# EAGLE design Pluvion 2 - Rev C (EAGLE 7.6.0)

## Sheet 1 of 3
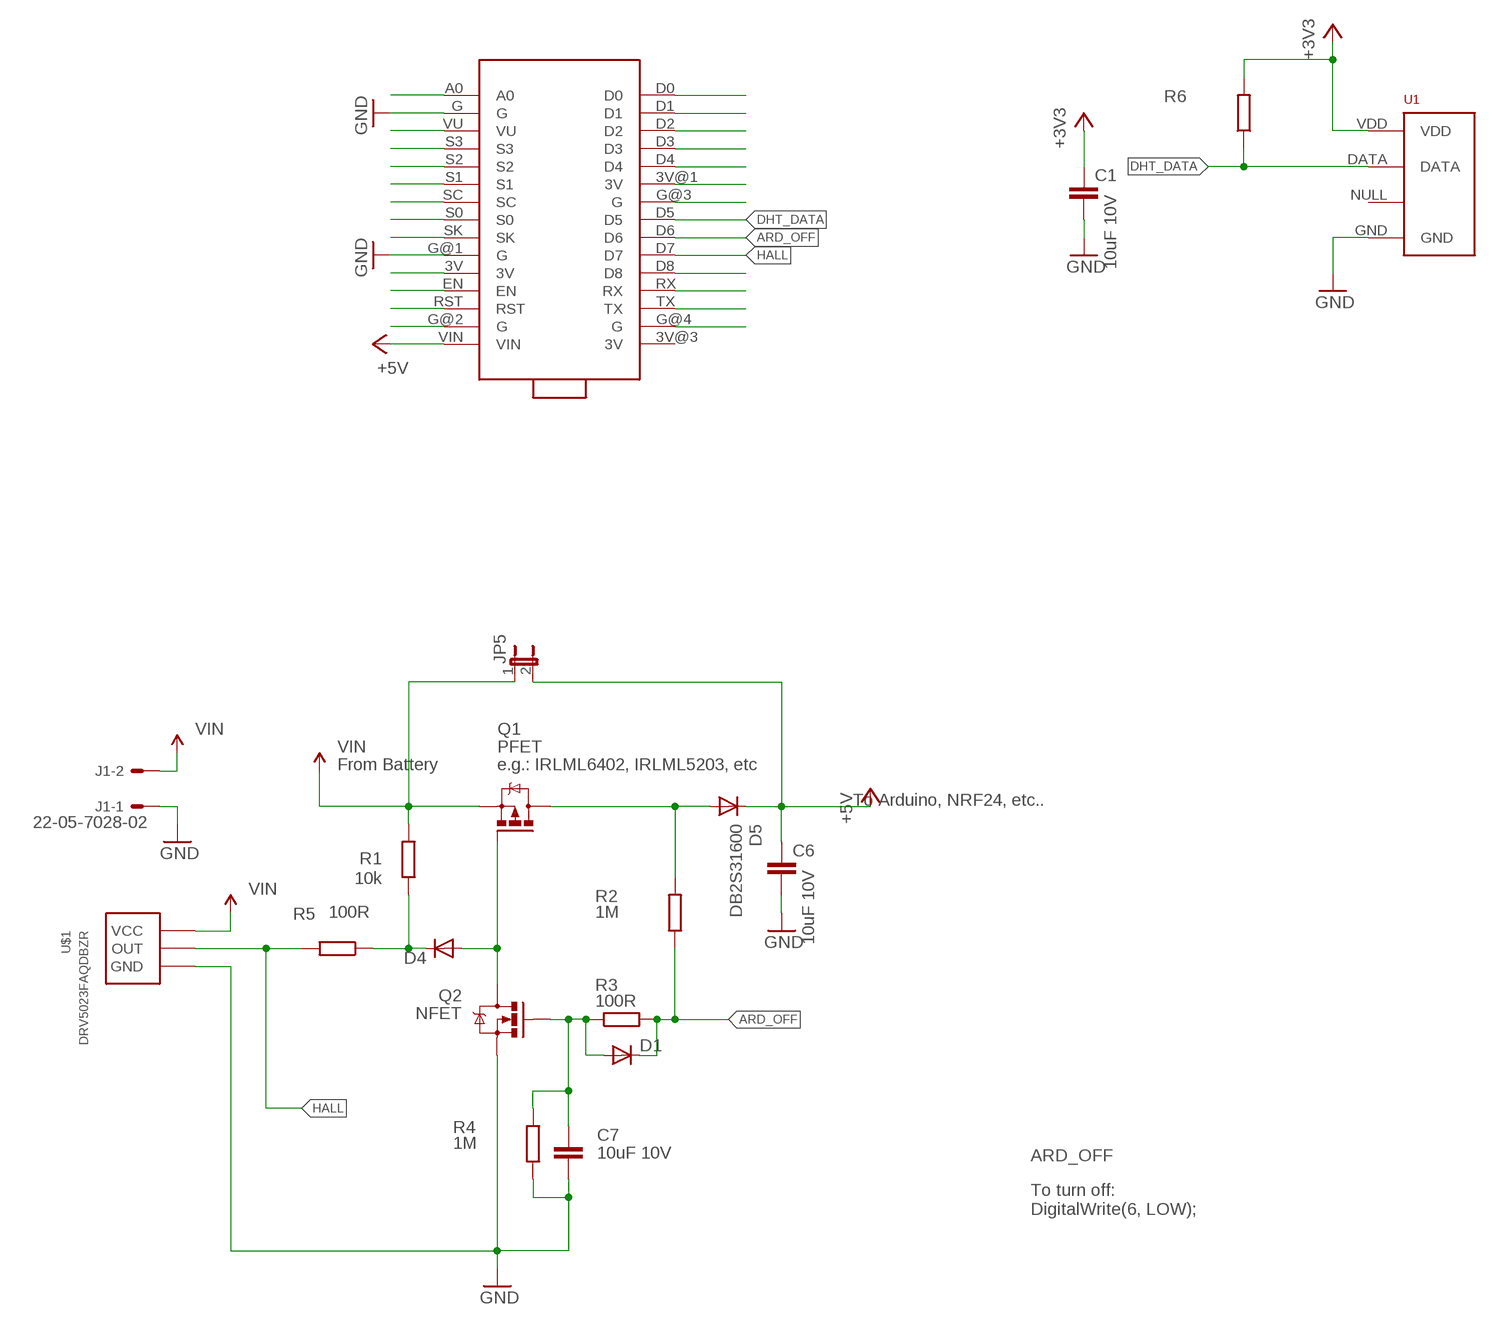
[diagram p0: schematic, sheet 1]

### Parts
C1  10uF 10V  C-EUC0805  [C0805]
C6  10uF 10V  C-EUC0805  [C0805]
C7  10uF 10V  C-EUC0805  [C0805]
D1  DIODESOD  [SOD-323]
D4  DIODESOD  [SOD-323]
D5  DB2S31600  DIODESMA  [SMA-DIODE]
J1  22-05-7028-02  [7395-02]
JP5  JUMPER-2PTH  [1X02]
Q1  PFET  IRLML5203  [MICRO3]
Q2  NFET  MOSFET-NCHANNELBSS123LT1G  [SOT23]
R1  10k  R-EU_R0805  [R0805]
R2  1M  R-EU_R0805  [R0805]
R3  100R  R-EU_R0805  [R0805]
R4  1M  R-EU_R0805  [R0805]
R5  100R  R-EU_R0805  [R0805]
R6  R-EU_R0805  [R0805]
U1  RHT03_DHT-22_AM2302RA  [RHT03_DHT-22/RA]
U$1  DRV5023FAQDBZR  [SOT23]
U$2  NODE-LOLIN-ESP8266  [NODE-LOLIN-ESP8266]

### Nets
+3V3: C1.1 R6.2 U1.VDD U$2.3V@1(3V)
+5V: C6.1 D5.C JP5.2 U$2.VIN
ARD_OFF: D1.1(C) R2.1 R3.2 U$2.D6
BUTTONS: D4.2(A) Q1.1(G) Q2.3(D)
DHT_DATA: R6.1 U1.DATA U$2.D5
GND: C1.2 C6.2 C7.2 J1.1 Q2.2(S) R4.1 U1.GND U$1.3(GND) U$2.G U$2.G@1(G)
HALL: R5.2 U$1.2(OUT) U$2.D7
N$1: D5.A Q1.3(D) R2.2
N$2: C7.1 D1.2(A) Q2.1(G) R3.1 R4.2
N$3: U$2.D0
N$4: U$2.D1
N$5: U$2.D2
N$6: U$2.D3
N$7: U$2.D4
N$8: D4.1(C) R1.1 R5.1
N$11: U$2.D8
N$12: U$2.G@3(G)
N$13: U$2.G@4(G)
N$15: U$2.RX
N$16: U$2.TX
N$17: U$2.3V
N$19: U$2.A0
N$21: U$2.VU
N$22: U$2.S3
N$23: U$2.S2
N$24: U$2.S1
N$25: U$2.SC
N$26: U$2.S0
N$27: U$2.SK
N$30: U$2.EN
N$31: U$2.RST
N$32: U$2.G@2(G)
VIN: J1.2 JP5.1 Q1.2(S) R1.2 U$1.1(VCC)
Unconnected: U1.NULL U$2.3V@3(3V)

### Notes on the sheet
- From Battery | e.g.: IRLML6402, IRLML5203, etc
- To Arduino, NRF24, etc..
- To turn off:
  DigitalWrite(6, LOW);

## Sheet 2 of 3

## Sheet 3 of 3

## Library data of the parts
C1 C6 C7 = wes:C-EU: CAPACITOR, European symbol
D1 D4 = SparkFun-DiscreteSemi:DIODE: Diode These are standard reverse protection diodes and small signal diodes. SMA package can handle up to about 1A. SOD-323 can handle about 200mA. What the SOD-323 package when ordering, there are some mfgs out there that are 5-pin packages.; PROD_ID: DIO-09646
D5 = SparkFun-DiscreteSemi:DIODE: Diode These are standard reverse protection diodes and small signal diodes. SMA package can handle up to about 1A. SOD-323 can handle about 200mA. What the SOD-323 package when ordering, there are some mfgs out there that are 5-pin packages.
J1 = con-molex:22-?-02: CONNECTOR wire to board 2.54 mm (.1 inch) pitch header; OC_FARNELL: 9731601; OC_NEWARK: unknown
JP5 = SparkFun-Passives:JUMPER-2: Jumper Basic 0.1" spaced jumper. Use with breakaway headers.
Q1 = transistor-power:IRLML5203: HEXFET P-Channel Power MOSFET
Q2 = SparkFun-DiscreteSemi:MOSFET-NCHANNEL: Common NMOSFET Parts MFG P/N Store ID Prod ID FDD8780 TRANS-09984 SI7820DN TRANS-11055 FDS6630A IC-08089 2N7002PW TRANS-11151 FQP30N06L COM-10213 TRANS-10060 BSS123LT1G TRANS-08345 BSS138 TRANS-00830 BS170 2N7000; PROD_ID: TRANS-08345
R1-R6 = wes:R-EU_: RESISTOR, European symbol
U1 = RHT03_DHT-22_AM2302:RHT03_DHT-22_AM2302: RHT03 / DHT-22 / AM2302 Packages and symbol for the RHT03 / DHT-22 relative humidity and temperature sensor. Note: The AM2302 is a wired version of the DHT-22 which typically requires less clearance and is thus provided as a separate package.; PROD_ID: SEN-10167
U$1 = lib_pluvion:DRV5023FAQDBZR: Digital Switch Hall Sensor
U$2 = wes:NODE-LOLIN-ESP8266

## Board
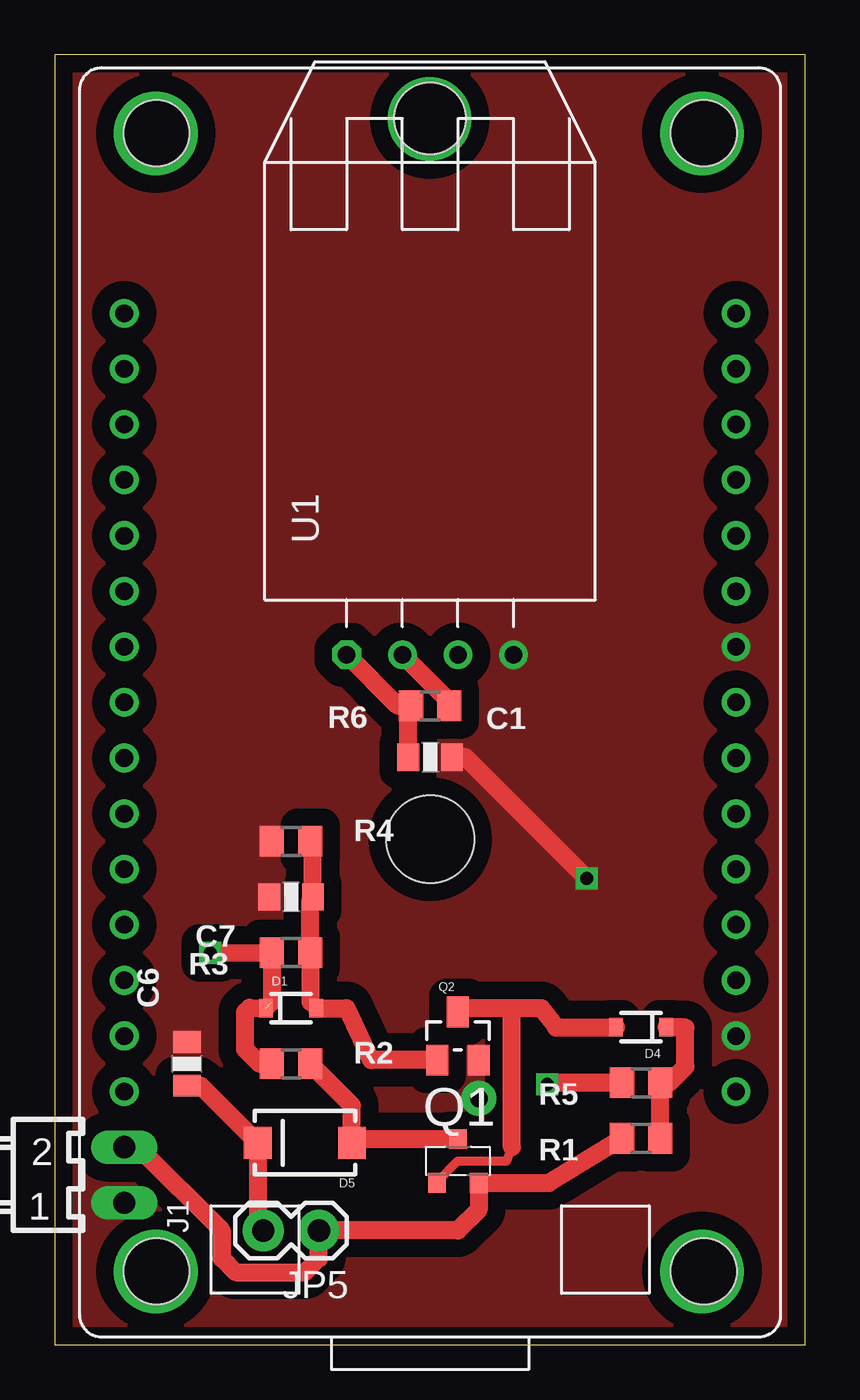
[diagram p1: board, top side]
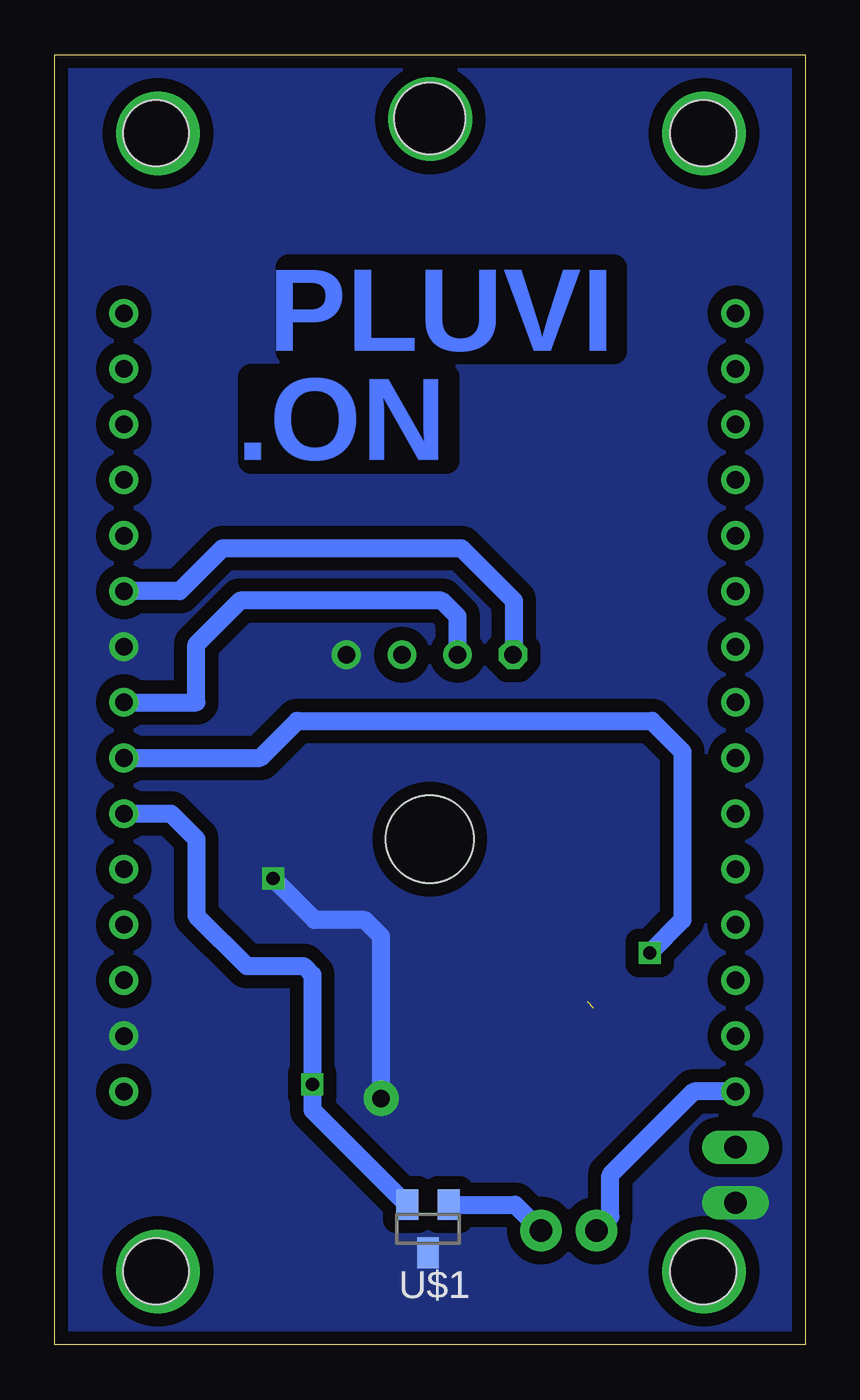
[diagram p2: board, bottom side, seen from below]

Size 34.27 x 58.94 mm. Coordinates in mm from the lower left corner, seen from the top.
Outline: 0,0 34.27,0 34.27,58.94 0,58.94 0,0
Copper layers (1*16): Top 0.035mm / dielectric 1.5mm / Bottom 0.035mm
Design rules "default *": minimum track width 10mil, minimum drill 0.6mm, track to track 8mil, track to pad 8mil, pad to pad 8mil, via to via 8mil, smd to smd 8mil, copper to edge 10mil, drill to drill 8mil, minimum pad ring 10mil, minimum via ring 8mil, stop-mask expansion 4mil, vias tented up to drill 0mil, thermal gap 10mil
Holes 4 mm at 17.14,23.1

### Footprints (pad centres in the part's own frame; a part is rotated, then mirrored left to right if it is on the bottom)
C0805 = smd 1 x 1.25: 1 -1,0; 2 1,0
SOD-323 = smd 0.63 x 0.83: 1 -1.15,0; 2 1.15,0
SMA-DIODE = smd 1.27 x 1.47: A -2.15,0; C 2.15,0
7395-02 = drill 1.016 long: 1 1.27,0; 2 -1.27,0
1X02 = drill 1.016 pad 1.88: 1 0,0; 2 2.54,0
MICRO3 = smd 0.8 x 0.9: 1 -0.95,-1; 2 0.95,-1; 3 0,1
SOT23 = smd 1 x 1.4: 1 -0.95,-1.1; 2 0.95,-1.1; 3 0,1.1
R0805 = smd 1.1 x 1.4: 1 -0.875,0; 2 0.875,0
RHT03_DHT-22/RA = drill 0.8: DATA -1.27,0; GND 3.81,0; NULL 1.27,0 | drill 0.8 octagon: VDD -3.81,0 | hole 3.25: 0,24.5
NODE-LOLIN-ESP8266 = drill 0.8: 3V -13.97,17.78; 3V@1 -13.97,-5.08; 3V@3 13.97,7.62; A0 13.97,-17.78; D0 -13.97,-17.78; D1 -13.97,-15.24; D2 -13.97,-12.7; D3 -13.97,-10.16; D4 -13.97,-7.62; D5 -13.97,0; D6 -13.97,2.54; D7 -13.97,5.08; D8 -13.97,7.62; EN 13.97,10.16; G -13.97,15.24; G@1 -13.97,-2.54; G@2 13.97,-15.24; G@3 13.97,5.08; G@4 13.97,15.24; RST 13.97,12.7; RX -13.97,10.16; S0 13.97,0; S1 13.97,-5.08; S2 13.97,-7.62; S3 13.97,-10.16; SC 13.97,-2.54; SK 13.97,2.54; TX -13.97,12.7; VIN 13.97,17.78; VU 13.97,-12.7 | hole 3: -12.5,26; 12.5,26; -12.5,-26; 12.5,-26

### Placement (x,y rotation side)
C1  17.14,26.85 0 top
C6  6.03,12.84 90 top
C7  10.79,20.46 180 top
D1  10.79,15.38 0 top
D4  26.78,14.51 180 top
D5  11.43,9.23 180 top
J1  3.17,7.76 270 top
JP5  12.06,5.22 180 top
Q1  18.41,8.39 0 top
Q2  18.41,14.11 0 top
R1  26.78,9.43 180 top
R2  10.79,12.84 0 top
R3  10.79,17.92 180 top
R4  10.79,23 0 top
R5  26.78,11.97 180 top
R6  17.14,29.19 180 top
U1  17.14,31.53 0 top
U$1  17.23,5.3 180 bottom
U$2  17.14,29.35 180 top

### Tracks (layer width: path | path; a pad name or v marks a point on that pad's centre or on a via)
+3V3
  Top 0.813: C1.1 16.14,29.07 R6.2 15.68,29.19 U1.VDD
  Bottom 0.813: U1.VDD 13.3,31.57 13.3,34 15.7,36.4 26.6,36.4 28.57,34.43 U$2.3V@1
+5V
  Top 0.813: JP5.2 9.28,5.47 D5.C 6.67,11.84 C6.1
  Bottom 0.813: U$2.VIN 5.08,11.57 8.89,7.76 8.89,5.86 JP5.2
ARD_OFF  (via drill 0.6)  (1 unrouted)
  Top 0.813: v7.1,17.9 R3.2 9.92,15.65 | R2.1 9.36,12.84 8.7,13.5 8.7,15.2 8.9,15.4 D1.1
  Bottom 0.813: v7.1,17.9 5.6,19.4 5.6,27.1 7,28.5 23.2,28.5 24.89,26.81 U$2.D6
BUTTONS
  Top 0.406: 18.59,15.38 Q2.3 | Q1.1 17.46,7.45 18.41,8.39 20.64,8.39 20.87,9.03
  Top 0.813: 20.87,15.38 22.23,15.38 22.9,14.5 D4.2 | 20.87,15.38 18.59,15.38 | 20.87,9.03 20.87,15.38
DHT_DATA
  Top 0.813: R6.1 18.02,29.39 U1.DATA
  Bottom 0.813: U1.DATA 15.88,33.27 16.6,34 25.8,34 27.8,32 27.8,29.35 U$2.D5
GND  (via drill 0.6, 0.8 pad 1.6)
  Top 0.813: v24.3,21.3 18.75,26.85 C1.2
  Bottom 0.813: v19.37,11.25 19.37,18.67 20.1,19.4 22.4,19.4 v24.3,21.3
  pour Top (isolate 0.813, no thermals): -10.16,73.66 90.17,73.66 90.17,-12.7 -10.16,-12.7
  pour Bottom (isolate 0.61, no thermals): -6.35,72.39 43.18,72.39 43.18,-12.7 -6.35,-12.7
HALL  (via drill 0.6)
  Top 0.813: R5.2 22.57,11.97 v22.5,11.9
  Bottom 0.813: U$1.2 22.5,10.72 v22.5,11.9 22.5,16.9 22.9,17.3 25.5,17.3 27.8,19.6 27.8,23.1 28.97,24.27 U$2.D7
N$1
  Top 0.813: Q1.3 13.57,9.39 D5.A 13.57,10.94 R2.2
N$2
  Top 0.406: 11.79,22.88 R4.2 | 11.67,20.34 C7.1 | 11.67,15.65 D1.2
  Top 0.813: C7.1 11.79,22.88 | 11.67,20.34 R3.1 11.67,15.65 | D1.2 13.34,15.38 14.44,13.01 Q2.1
N$8
  Top 0.813: R1.1 R5.1 28.07,11.97 28.8,12.7 28.8,14.5 D4.1
N$9  (via drill 2.8)
  other vias: 4.61,3.35
N$10  (via drill 2.8)
  other vias: 29.56,3.35
N$14  (via drill 2.8)
  other vias: 17.12,23.1
N$18  (via drill 2.8)
  other vias: 4.61,55.35
N$20  (via drill 2.8)
  other vias: 29.56,55.35
N$28  (via drill 2.8)
  other vias: 17.12,56
VIN
  Top 0.813: R1.2 22.57,7.39 Q1.2 19.36,6.17 18.41,5.22 JP5.1 12.06,3.95 11.43,3.31 8.26,3.31 7.62,3.95 7.62,5.22 3.81,9.03 J1.2
  Bottom 0.813: U$1.1 13.24,6.4 JP5.1

### Text on the board
Bottom: PLUVI | .ON